# EAGLE design Schematic (EAGLE 8.1.0)
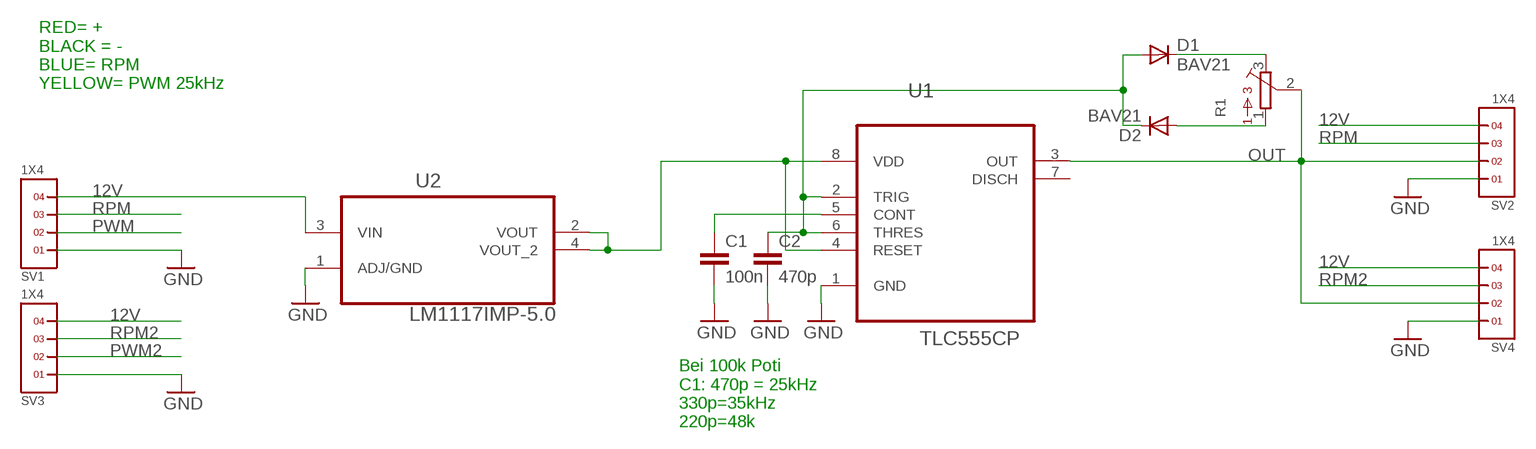
[diagram p0: schematic, sheet 1]

## Parts
C1  100n  C-EU025-025X050  [C025-025X050]
C2  470p  C-EU025-025X050  [C025-025X050]
D1  BAV21  [DO35-10]
D2  BAV21  [DO35-10]
R1  3362P  [3362P]
SV1  1X4  [1X4]
SV2  1X4  [1X4]
SV3  1X4  [1X4]
SV4  1X4  [1X4]
U1  TLC555CP  [DIP254P762X508-8]
U2  LM1117IMP-5.0  [SOT230P696X180-4N]

## Nets
12V [Power]: SV1.4 SV2.4 SV3.4 SV4.4 U2.3(VIN)
GND [Power]: C1.2 C2.2 SV1.1 SV2.1 SV3.1 SV4.1 U1.1(GND) U2.1(ADJ/GND)
N$1: C2.1 D1.A D2.C U1.2(TRIG) U1.6(THRES)
N$2: C1.1 U1.5(CONT)
N$4: D2.A R1.1
N$5: D1.C R1.3
OUT: R1.2 SV2.2 SV4.2 U1.3(OUT)
PWM: SV1.2
PWM2: SV3.2
RPM: SV1.3 SV2.3
RPM2: SV3.3 SV4.3
VDD: U1.4(RESET) U1.8(VDD) U2.2(VOUT) U2.4(VOUT_2)
Unconnected: U1.7(DISCH)

## Notes on the sheet
- RED= +
  BLACK = -
  BLUE= RPM
  YELLOW= PWM 25kHz
- Bei 100k Poti
  C1: 470p = 25kHz
  330p=35kHz
  220p=48k

## Library data of the parts
C1 C2 = rcl:C-EU: CAPACITOR, European symbol
D1 D2 = diode:BAV21: DIODE high-voltage general purpose diode
R1 = bourns:3362: 3362 Series 1/4" Square Trimmer
SV1-SV4 = headers(2mm):1X4
U1 = Texas Instruments_By_element14_Batch_1:TLC555CP: LinCMOSE TIMERS; MPN: TLC555CP; OC_FARNELL: 1103036; OC_NEWARK: 36K2064; PACKAGE: PDIP-8; SUPPLIER: Texas Instruments
U2 = NSC_By_element14_Batch_1.1:LM1117IMP-5.0: IC REG LDO 800MA 5.0V; MPN: LM1117IMP-5.0; OC_FARNELL: -; OC_NEWARK: 41K3451; PACKAGE: SOT-223; SUPPLIER: National Semiconductor

## Net classes
0 Standard: width 0.254 mm, clearance 0.254 mm
1 Power: width 0.508 mm, clearance 0.381 mm

## Board
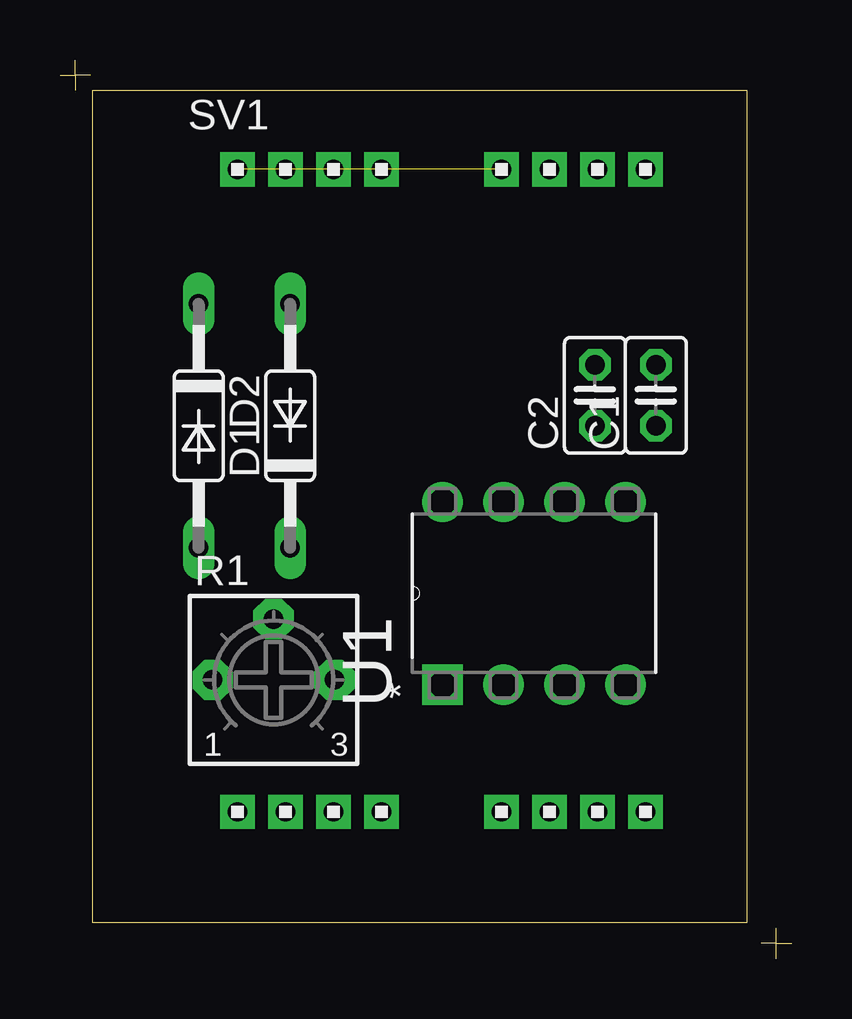
[diagram p1: board, top side]
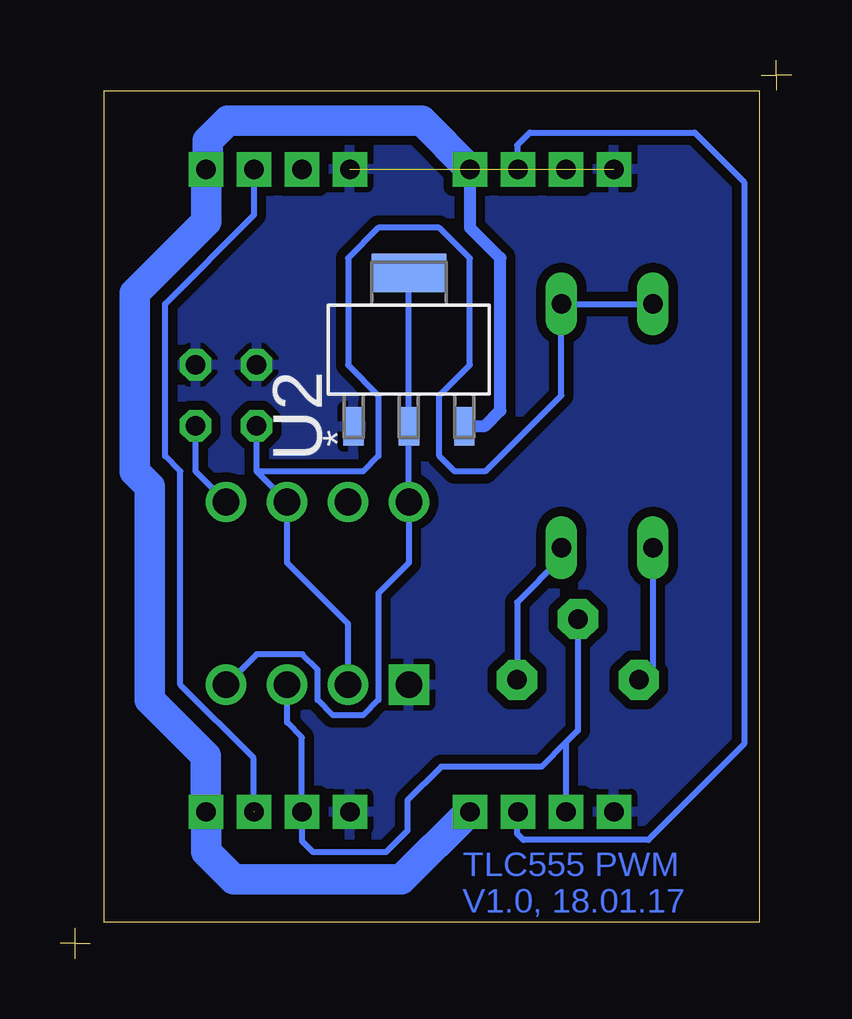
[diagram p2: board, bottom side, seen from below]

Size 30.48 x 37.47 mm. Coordinates in mm from the lower left corner, seen from the top.
Outline: 0,36.83 0.64,36.83
Outline: 1.27,36.83 0.64,36.83
Outline: 0.64,36.83 0.64,36.2
Outline: 0.64,36.83 0.64,37.47
Outline: 29.84,0.64 29.84,1.27
Outline: 29.84,0 29.84,0.64
Outline: 29.84,0.64 29.21,0.64
Outline: 29.84,0.64 30.48,0.64
Outline: 1.33,1.51 28.63,1.51 28.63,36.18 1.33,36.18 1.33,1.51
Copper layers (1*16): Top 0.035mm / dielectric 1.5mm / Bottom 0.035mm
Design rules "default *": minimum track width 10mil, minimum drill 24mil, track to track 8mil, track to pad 8mil, pad to pad 8mil, via to via 8mil, smd to smd 8mil, copper to edge 20mil, drill to drill 8mil, minimum pad ring 10mil, minimum via ring 8mil, stop-mask expansion 4mil, vias tented up to drill 0mil, thermal gap 10mil

### Footprints (pad centres in the part's own frame; a part is rotated, then mirrored left to right if it is on the bottom)
C025-025X050 = drill 0.813 octagon: 1 -1.27,0; 2 1.27,0
DO35-10 = drill 0.813 long: A 5.08,0; C -5.08,0
3362P = drill 0.813 pad 1.676 octagon: 1 -2.54,0; 2 0,2.54; 3 2.54,0
1X4 = drill 0.8 pad 1.422 square: 1 -3,0; 2 -1,0; 3 1,0; 4 3,0
DIP254P762X508-8 = drill 1.118 square: 1 -7.62,7.62 | drill 1.118: 2 -7.62,5.08; 3 -7.62,2.54; 4 -7.62,0; 5 0,0; 6 0,2.54; 7 0,5.08; 8 0,7.62
SOT230P696X180-4N = smd 1.6 x 0.838: 1 -3.2,2.311; 2 -3.2,0; 3 -3.2,-2.311 | smd 1.6 x 3.099: 4 3.2,0

### Placement (x,y rotation side)
C1  24.83,23.48 90 top
C2  22.29,23.48 90 top
D1  9.59,22.21 90 top
D2  5.78,22.21 270 top
R1  8.9,11.62 0 top
SV1  10.4,32.91 0 top
SV2  10.4,6.13 0 top
SV3  21.4,32.91 0 top
SV4  21.4,6.13 0 top
U1  23.56,19.04 90 top
U2  15.94,25.39 90 bottom

### Tracks (layer width: path | path; a pad name or v marks a point on that pad's centre or on a via)
12V
  Bottom 0.508: U2.3 13.6,22.21 12.76,22.21 12.13,22.85 12.13,29.21 13.4,30.47 | SV1.4 13.4,30.47 | 13.4,30.47
  Bottom 1.27: SV1.4 15.42,34.93 23.5,34.93 24.32,34.1 24.32,32.98 SV3.4 24.38,32.89 24.38,30.73 27.37,27.75 27.37,20.31 26.73,19.68 26.73,10.79 24.4,8.45 SV4.4 24.38,6.11 24.38,4.45 23.24,3.3 16.26,3.3 13.43,6.13 SV2.4
GND  (1 unrouted)
  Bottom 0.508: U2.1 18.28,22.21
  pour Bottom: 1.27,36.07 28.57,36.07 28.7,36.07 28.7,1.27 1.4,1.27 1.4,1.52 1.14,1.52 1.14,35.94 1.27,35.94
N$1
  Bottom 0.254: D2.C D1.A 9.59,23.48 12.76,20.31 14.04,20.31 14.67,20.95 14.67,23.48 13.4,24.76 13.4,29.2 14.67,30.47 17.21,30.47 18.48,29.2 18.48,24.76 17.21,23.48 17.21,20.95 17.84,20.31 22.29,20.31 | 22.29,20.31 C2.1 | 22.29,20.31 U1.6 21.02,16.5 18.48,13.96 U1.2
N$2
  Bottom 0.254: C1.1 24.83,20.31 U1.5
N$4
  Bottom 0.254: D2.A 5.78,12.2 R1.1
N$5
  Bottom 0.254: D1.C 9.59,16.7 11.43,14.86 R1.3
OUT
  Bottom 0.254: U1.3 21.02,9.84 20.4,9.22 SV4.2 20.4,4.9 19.94,4.45 16.89,4.45 16,5.33 16,6.6 14.61,8 10.41,8 9.4,9.02 | R1.2 8.9,9.52 9.4,9.02 | SV2.2 9.4,9.02
RPM
  Bottom 0.254: SV1.3 11.43,32.94 11.43,33.91 10.9,34.44 4.03,34.44 1.97,32.38 1.97,8.95 5.97,4.95 11.18,4.95 11.43,5.21 11.43,6.09 SV2.3
RPM2  (1 unrouted)
  Bottom 0.254: SV3.3 22.4,31 26.1,27.3 26.1,20.95 25.46,20.31 25.46,11.42 22.41,8.37 22.41,6.15
VDD
  Bottom 0.254: U2.4 U2.2 U1.8 15.94,16.5 17.21,15.23 17.21,10.79 17.84,10.15 19.11,10.15 19.75,10.79 19.75,12.05 20.38,12.69 22.29,12.69 U1.4

### Text on the board
Bottom: TLC555 PWM / V1.0, 18.01.17